# Altium schematic sheet ul_tx_ctrl.SchDoc: Opo4
size Letter; Author: William W. Huang; Organization: Altium Limited; Address1: L3, 12a Rodborough Rd; Address2: Frenchs Forest; Address3: NSW; Address4: Australia 2086; Revision: 1
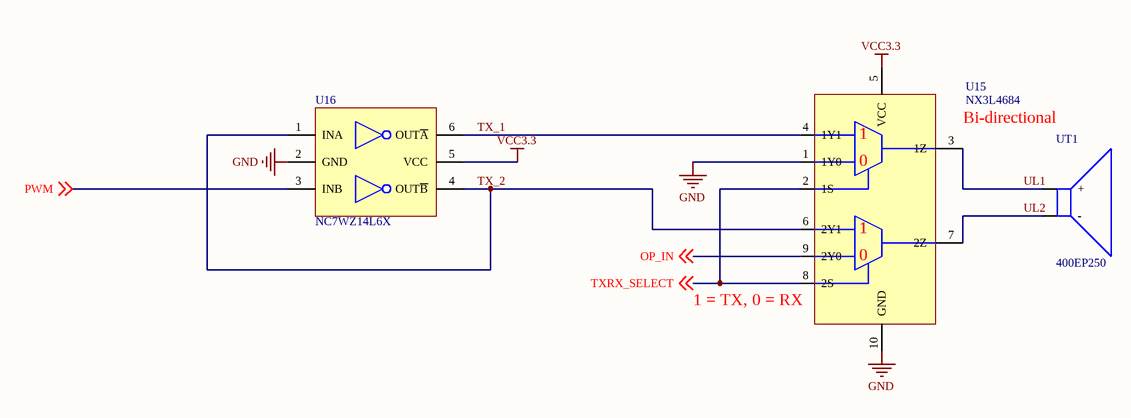
[diagram p0: ul_tx_ctrl.SchDoc]

## Parts
U15  NX3L4684  [QFN50P155X200X13-10N]
U16  NC7WZ14L6X  [NC7WZ14L6X]
UT1  400EP250  [Transducer recepticle]

## Nets
GND: U15.1(1Y0) U15.10(GND) U16.2(GND)
VCC3.3: U15.5(VCC) U16.5(VCC)
OP_IN: U15.9(2Y0) ; off-sheet OP_IN
PWM: U16.3(INB) ; off-sheet PWM
TX_1: U15.4(1Y1) U16.6(OUT~{A})
TX_2: U15.6(2Y1) U16.1(INA) U16.4(OUT~{B})
TXRX_SELECT: U15.2(1S) U15.8(2S) ; off-sheet TXRX_SELECT
UL1: U15.3(1Z) UT1.2(+)
UL2: U15.7(2Z) UT1.1(-)

## Notes on the sheet
- (near U15) Bi-directional
- (near U15) 1 = TX, 0 = RX
- Title
- Date:
- Author:
- Revision:
- Sheet
- of
- University of Michigan
- File:
- (in symbol NX3L4684) 0

## Library data of the parts
U15 = NX3L4684: IC ANALOG SWITCH SPDT 10XQFN; Supplier 1: Digi-Key; Supplier Part Number 1: 568-5564-1-ND
U16 = NC7WZ14L6X: 1 uA supply current, 50 mA output current, Dual inverter; Mfr: Fairchild Semiconductor; Supplier 1: Digikey; Supplier Part Number 1: NC7WZ14L6XFSCT-ND; Mfr Part Number: NC7WZ14L6X
UT1 = Tranducer: Air Ultrasounic Ceramic Transducers; Supplier 1: Digi-Key; Supplier Part Number 1: ED90088-ND